# EAGLE design 12v-driver (EAGLE 9.4.2)
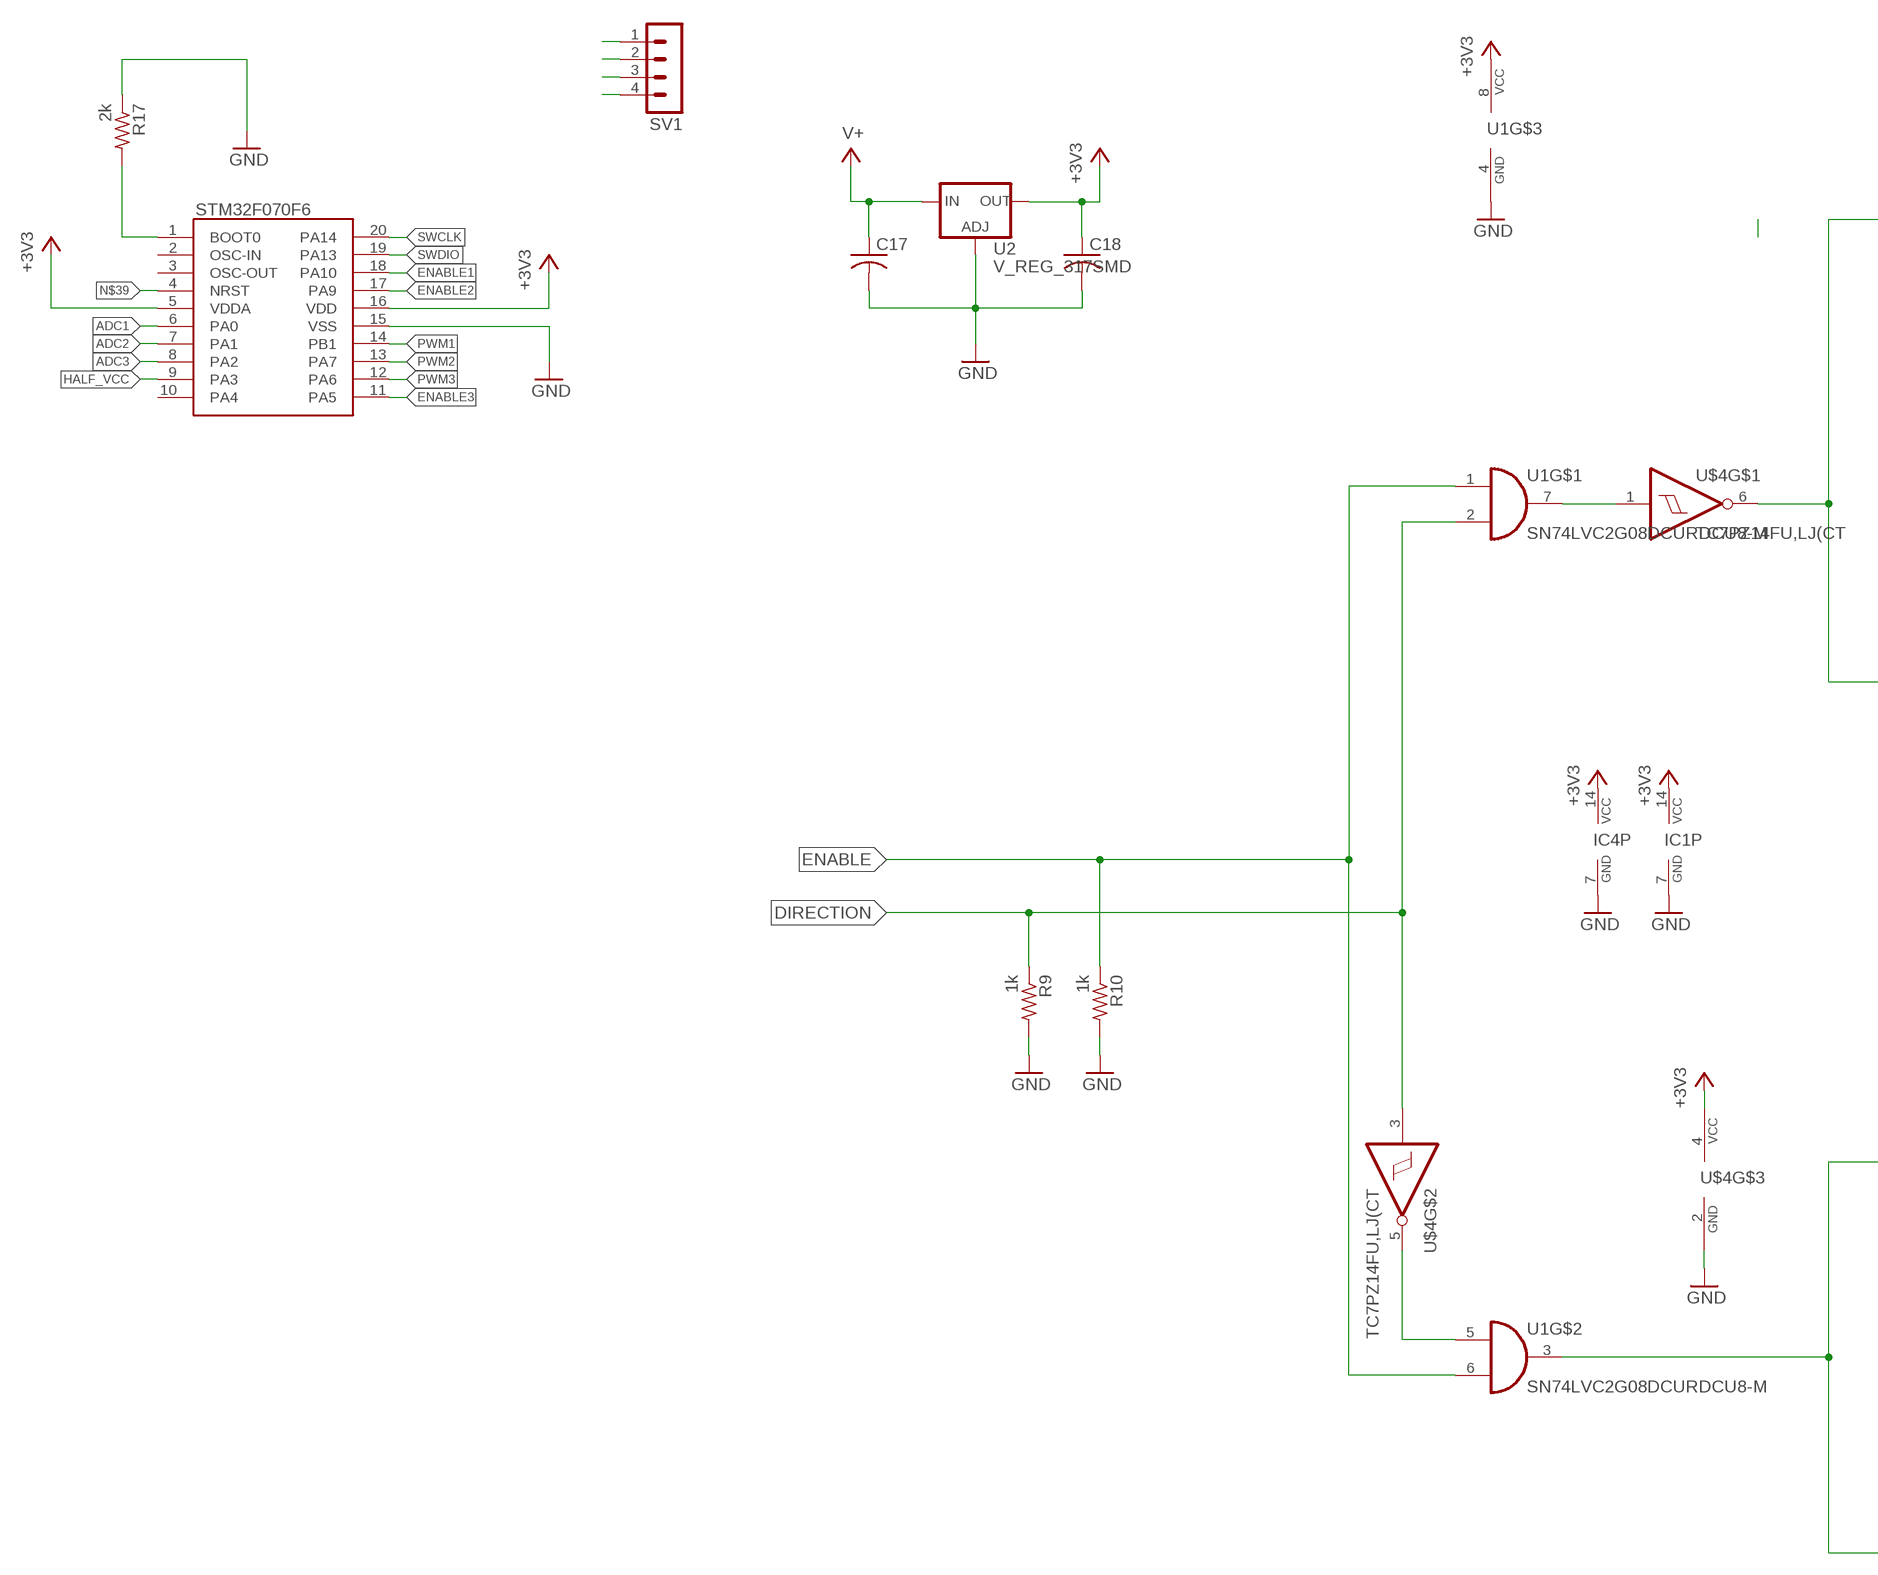
[diagram p0: schematic, sheet 1, part 1 of 2]
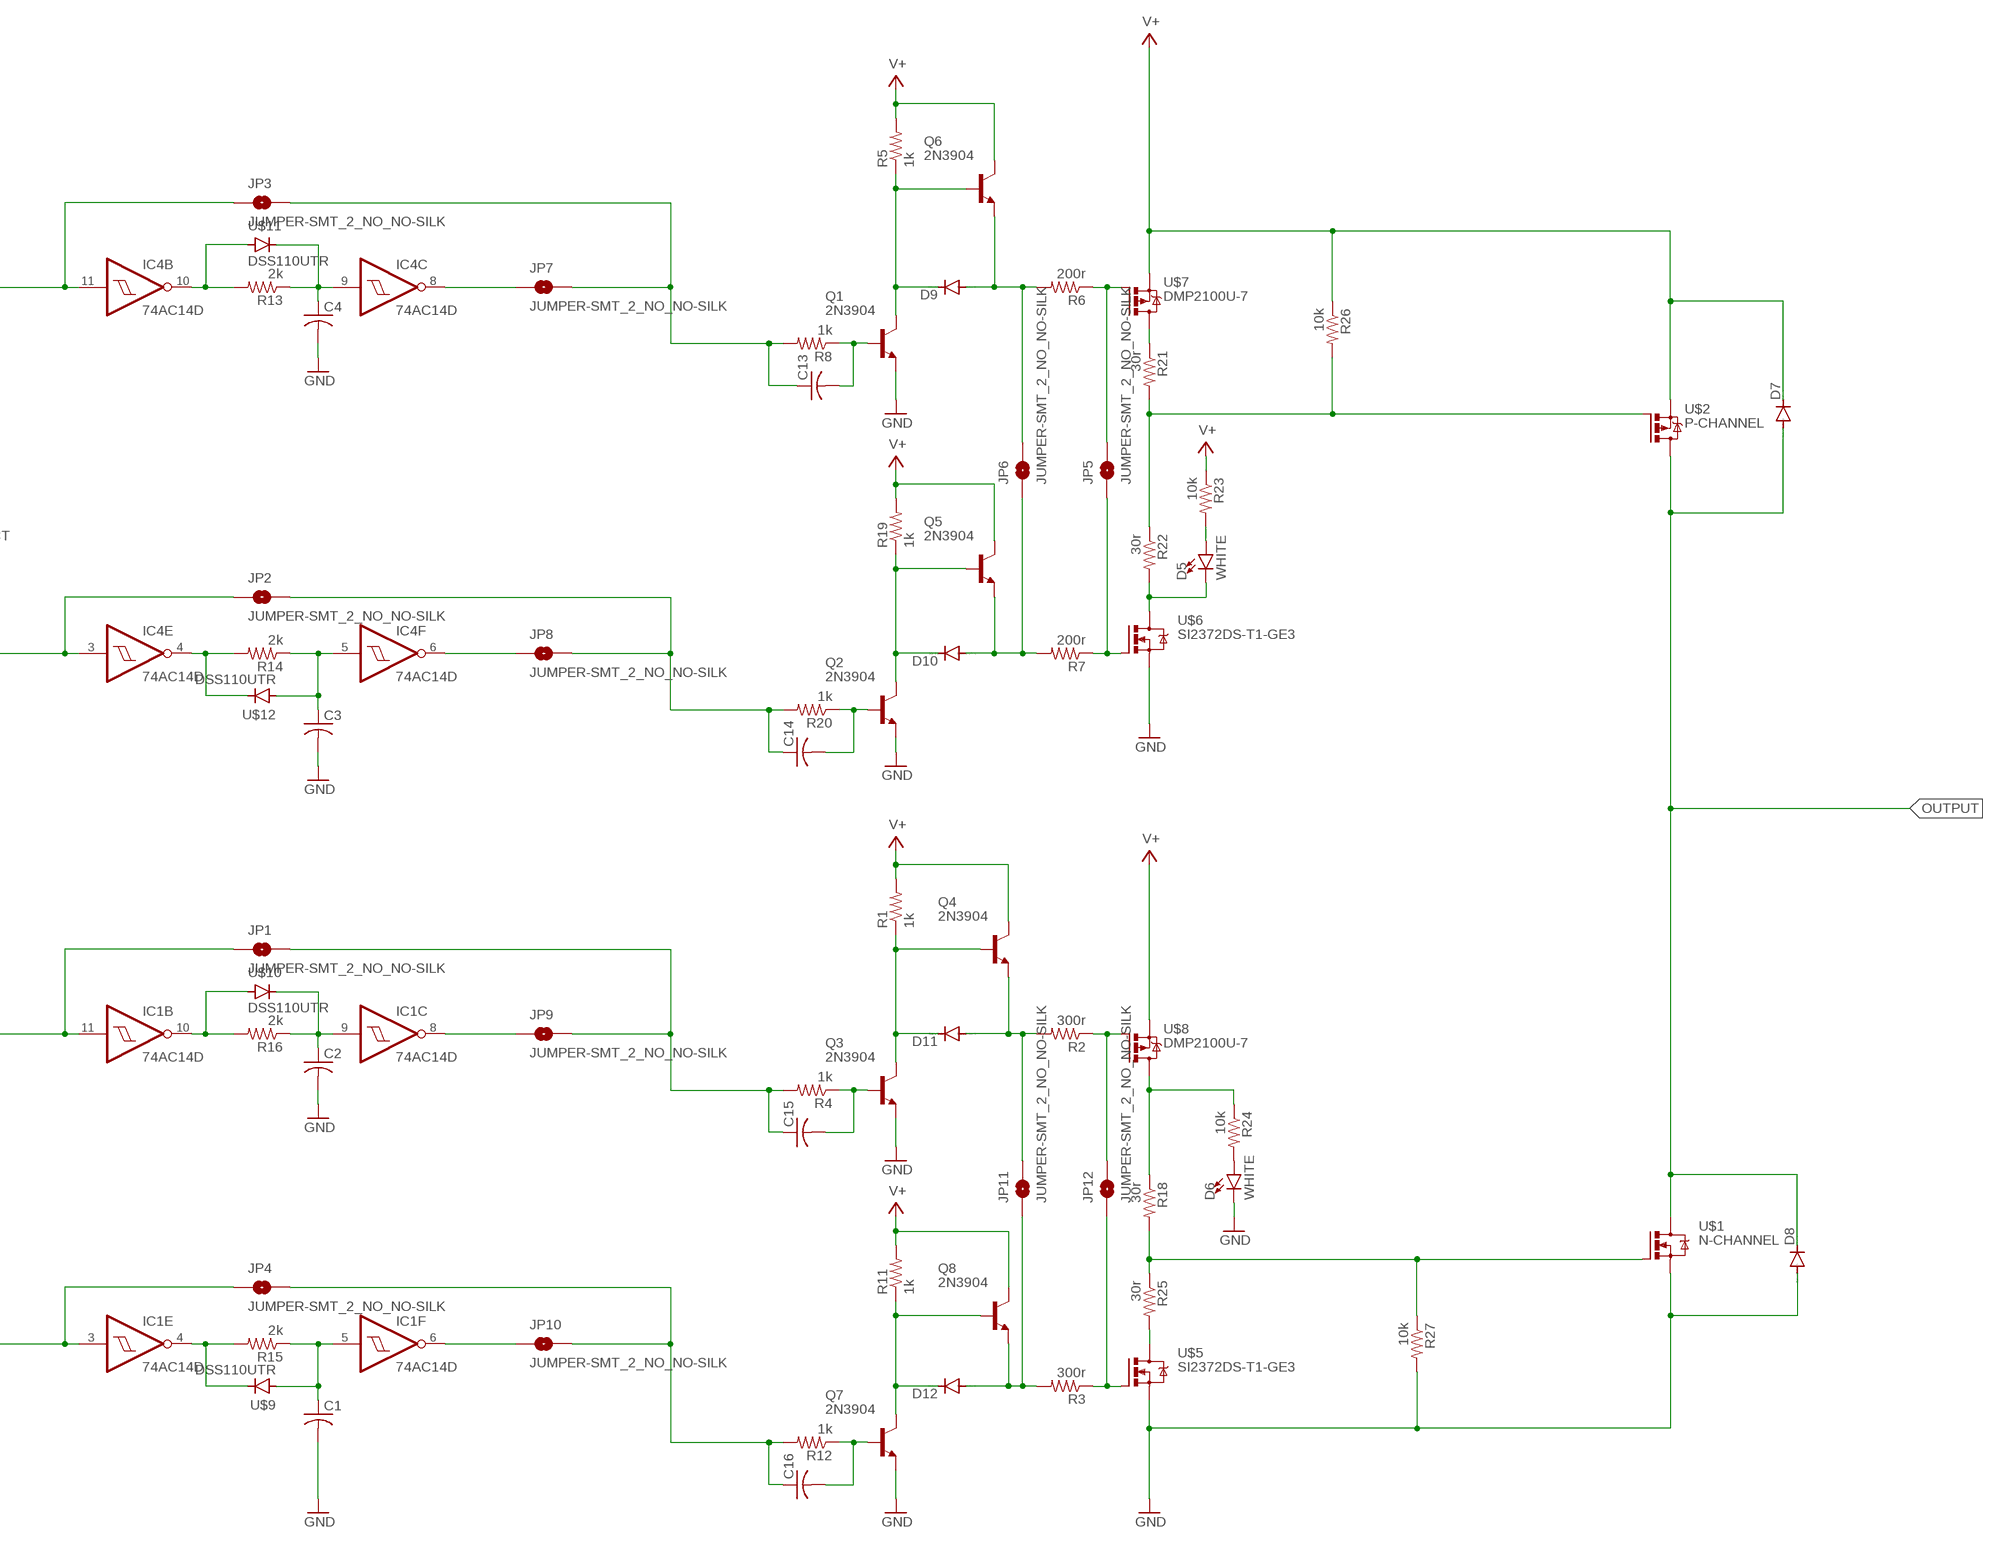
[diagram p1: schematic, sheet 1, part 2 of 2]

## Parts
C1  C-USC0603  [C0603]
C2  C-USC0603  [C0603]
C3  C-USC0603  [C0603]
C4  C-USC0603  [C0603]
C13  C-USC0603  [C0603]
C14  C-USC0603  [C0603]
C15  C-USC0603  [C0603]
C16  C-USC0603  [C0603]
C17  C-US075-032X103  [C075-032X103]
C18  C-US075-032X103  [C075-032X103]
D5  WHITE  LED-WHITE1206  [LED-1206]
D6  WHITE  LED-WHITE1206  [LED-1206]
D7  DIODE-DO-214AC  [DO-214AC]
D8  DIODE-DO-214AC  [DO-214AC]
D9  DIODE-DO-214AC  [DO-214AC]
D10  DIODE-DO-214AC  [DO-214AC]
D11  DIODE-DO-214AC  [DO-214AC]
D12  DIODE-DO-214AC  [DO-214AC]
IC1  74AC14D  [SO14]
IC4  74AC14D  [SO14]
JP1  JUMPER-SMT_2_NO_NO-SILK  [SMT-JUMPER_2_NO_NO-SILK]
JP2  JUMPER-SMT_2_NO_NO-SILK  [SMT-JUMPER_2_NO_NO-SILK]
JP3  JUMPER-SMT_2_NO_NO-SILK  [SMT-JUMPER_2_NO_NO-SILK]
JP4  JUMPER-SMT_2_NO_NO-SILK  [SMT-JUMPER_2_NO_NO-SILK]
JP5  JUMPER-SMT_2_NO_NO-SILK  [SMT-JUMPER_2_NO_NO-SILK]
JP6  JUMPER-SMT_2_NO_NO-SILK  [SMT-JUMPER_2_NO_NO-SILK]
JP7  JUMPER-SMT_2_NO_NO-SILK  [SMT-JUMPER_2_NO_NO-SILK]
JP8  JUMPER-SMT_2_NO_NO-SILK  [SMT-JUMPER_2_NO_NO-SILK]
JP9  JUMPER-SMT_2_NO_NO-SILK  [SMT-JUMPER_2_NO_NO-SILK]
JP10  JUMPER-SMT_2_NO_NO-SILK  [SMT-JUMPER_2_NO_NO-SILK]
JP11  JUMPER-SMT_2_NO_NO-SILK  [SMT-JUMPER_2_NO_NO-SILK]
JP12  JUMPER-SMT_2_NO_NO-SILK  [SMT-JUMPER_2_NO_NO-SILK]
Q1  2N3904  [TO-92]
Q2  2N3904  [TO-92]
Q3  2N3904  [TO-92]
Q4  2N3904  [TO-92]
Q5  2N3904  [TO-92]
Q6  2N3904  [TO-92]
Q7  2N3904  [TO-92]
Q8  2N3904  [TO-92]
R1  1k  R-US_R0603  [R0603]
R2  300r  R-US_R0603  [R0603]
R3  300r  R-US_R0603  [R0603]
R4  1k  R-US_R0603  [R0603]
R5  1k  R-US_R0603  [R0603]
R6  200r  R-US_R0603  [R0603]
R7  200r  R-US_R0603  [R0603]
R8  1k  R-US_R0603  [R0603]
R9  1k  R-US_R0603  [R0603]
R10  1k  R-US_R0603  [R0603]
R11  1k  R-US_R0603  [R0603]
R12  1k  R-US_R0603  [R0603]
R13  2k  R-US_R0603  [R0603]
R14  2k  R-US_R0603  [R0603]
R15  2k  R-US_R0603  [R0603]
R16  2k  R-US_R0603  [R0603]
R17  2k  R-US_R0603  [R0603]
R18  30r  R-US_R0603  [R0603]
R19  1k  R-US_R0603  [R0603]
R20  1k  R-US_R0603  [R0603]
R21  30r  R-US_R0603  [R0603]
R22  30r  R-US_R0603  [R0603]
R23  10k  R-US_R0603  [R0603]
R24  10k  R-US_R0603  [R0603]
R25  30r  R-US_R0603  [R0603]
R26  10k  R-US_R0603  [R0603]
R27  10k  R-US_R0603  [R0603]
SV1  MA04-1  [MA04-1]
U1  SN74LVC2G08DCURDCU8-M  [DCU8-M]
U2  V_REG_317SMD  [SOT223]
U$1  N-CHANNEL  [TO247BV]
U$2  P-CHANNEL  [TO247BV]
U$3  STM32F070F6P6TR  [TSSOP20]
U$4  TC7PZ14FU,LJ(CT  [SOT-363___(US6)]
U$5  SI2372DS-T1-GE3  [SOT-23]
U$6  SI2372DS-T1-GE3  [SOT-23]
U$7  DMP2100U-7  [SOT-23]
U$8  DMP2100U-7  [SOT-23]
U$9  DSS110UTR  [SOD123FL]
U$10  DSS110UTR  [SOD123FL]
U$11  DSS110UTR  [SOD123FL]
U$12  DSS110UTR  [SOD123FL]

## Nets
+3V3: C18.1 IC1.14(P:VCC) IC4.14(P:VCC) U1.8(VCC) U2.2(OUT) U$3.5(VDDA) U$3.16(VDD) U$4.4(VCC)
ADC1: U$3.6(PA0)
ADC2: U$3.7(PA1)
ADC3: U$3.8(PA2)
DIRECTION: R9.1 U1.2(I1) U$4.3(I)
ENABLE: R10.1 U1.1(I0) U1.6(I1)
ENABLE1: U$3.18(PA10)
ENABLE2: U$3.17(PA9)
ENABLE3: U$3.11(PA5)
GND: C1.2 C2.2 C3.2 C4.2 C17.2 C18.2 D6.C D8.A IC1.7(P:GND) IC4.7(P:GND) Q1.E Q2.E Q3.E Q7.E R9.2 R10.2 R17.1 R27.2 U1.4(GND) U2.1(ADJ) U$1.S U$3.15(VSS) U$4.2(GND) U$5.2(S) U$6.2(S)
HALF_VCC: U$3.9(PA3)
IN1: IC1.3(E:I) IC1.11(B:I) JP1.1 JP4.1 U1.3(O)
IN2: IC4.3(E:I) IC4.11(B:I) JP2.1 JP3.1 U$4.6(O)
N$1: R18.2 R25.1 R27.1 U$1.G
N$2: R17.2 U$3.1(BOOT0)
N$3: D11.C Q3.C Q4.B R1.1
N$4: JP12.2 R2.1 U$8.1(G)
N$5: JP12.1 R3.1 U$5.1(G)
N$6: C15.2 Q3.B R4.1
N$7: R21.2 R22.1 R26.2 U$2.G
N$8: R18.1 R24.1 U$8.3(D)
N$9: D9.C Q1.C Q6.B R5.1
N$10: JP5.2 R6.1 U$7.1(G)
N$11: JP5.1 R7.1 U$6.1(G)
N$12: C13.2 Q1.B R8.1
N$13: IC1.10(B:O) R16.2 U$10.A
N$14: IC4.8(C:O) JP7.1
N$15: U1.5(I0) U$4.5(O)
N$16: C2.1 IC1.9(C:I) R16.1 U$10.C
N$17: C15.1 JP1.2 JP9.2 R4.2
N$18: C3.1 IC4.5(F:I) R14.1 U$12.A
N$19: IC4.6(F:O) JP8.1
N$20: C4.1 IC4.9(C:I) R13.1 U$11.C
N$21: C13.1 JP3.2 JP7.2 R8.2
N$22: IC4.10(B:O) R13.2 U$11.A
N$23: IC4.4(E:O) R14.2 U$12.C
N$24: IC1.8(C:O) JP9.1
N$25: IC1.4(E:O) R15.2 U$9.C
N$26: C1.1 IC1.5(F:I) R15.1 U$9.A
N$27: IC1.6(F:O) JP10.1
N$28: C16.1 JP4.2 JP10.2 R12.2
N$29: D5.A R23.2
N$30: D6.A R24.2
N$31: C16.2 Q7.B R12.1
N$32: D12.C Q7.C Q8.B R11.1
N$33: C14.2 Q2.B R20.1
N$34: C14.1 JP2.2 JP8.2 R20.2
N$35: D10.C Q2.C Q5.B R19.1
N$36: SV1.1
N$37: SV1.2
N$38: U1.7(O) U$4.1(I)
N$39: U$3.4(NRST)
N$40: R21.1 U$7.3(D)
N$41: D5.C R22.2 U$6.3(D)
N$42: R25.2 U$5.3(D)
N$43: D9.A JP6.2 Q6.E R6.2
N$44: D10.A JP6.1 Q5.E R7.2
N$46: SV1.3
N$47: D11.A JP11.2 Q4.E R2.2
N$48: D12.A JP11.1 Q8.E R3.2
N$49: SV1.4
OUTPUT: D7.A D8.C U$1.D U$2.D
PWM1: U$3.14(PB1)
PWM2: U$3.13(PA7)
PWM3: U$3.12(PA6)
SWCLK: U$3.20(PA14)
SWDIO: U$3.19(PA13)
V+: C17.1 D7.C Q4.C Q5.C Q6.C Q8.C R1.2 R5.2 R11.2 R19.2 R23.1 R26.1 U2.3(IN) U$2.S U$7.2(S) U$8.2(S)
Unconnected: IC1.1(D:I) IC1.2(D:O) IC1.12(A:O) IC1.13(A:I) IC4.1(D:I) IC4.2(D:O) IC4.12(A:O) IC4.13(A:I) U$3.2(OSC-IN) U$3.3(OSC-OUT) U$3.10(PA4)

## Library data of the parts
C1-C4 C13-C18 = rcl:C-US: CAPACITOR, American symbol; SPICEPREFIX: C
D5 D6 = SparkFun-LED:LED-WHITE: White SMD LED Used in manufacturing several products at SparkFun. Packages: 0603 - Bright White SMD 0603 package[Product Link] <http://www.kingbrightusa.com/product.asp?catalog_name=LED&product_id=APT1608QWF/D> 1206 - Bright White SMD1206 package [Product Link] <http://www.kingbrightusa.com/product.asp?catalog_name=LED&product_id=APT3216QWF/D> 3014 - Super Bright SMD 3014 package [Datasheet] <http://www.lumileds.com/uploads/459/DS208-pdf> SparkFun Products: Blackberry Trackballer Breakout <https://www.sparkfun.com/products/13169> Digital SandBox <https://www.sparkfun.com/products/12651>; PROD_ID: DIO-09955
D7-D12 = diode:DIODE-: DIODE
IC1 IC4 = 74xx-eu:74*14: Hex schmitt trigger INVERTER
JP1-JP12 = SparkFun-Jumpers:JUMPER-SMT_2_NO: Normally open jumper This jumper has two pads in close proximity to each other. Apply solder to close the connection. Round pads are easier to solder for beginners, but are a lot larger. SparkFun Product that uses the round pads: SparkFun EL Sequencer <https://www.sparkfun.com/products/12781>
Q1-Q8 = BLDC:2N3904
R1-R27 = rcl:R-US_: RESISTOR, American symbol; SPICEPREFIX: R
SV1 = con-lstb:MA04-1: PIN HEADER; OC_FARNELL: unknown; OC_NEWARK: unknown
U1 = BLDC:SN74LVC2G08DCUR; DATASHEET_URL: http://www.ti.com/lit/gpn/SN74LVC2G08; DESCRIPTION: Dual 2-Input Positive-AND Gate; FAMILY_NAME: LL AND GATE; GENERIC_PART_NUMBER: SN74LVC2G08; INDUSTRY_STD_PKG_TYPE: US8; MANUFACTURER: Texas Instruments; MANUFACTURER_PART_NUMBER: SN74LVC2G08DCUR; PACKAGE_DESIGNATOR: DCU; PIN_COUNT: 8; VENDOR: Texas Instruments
U2 = SparkFun-IC-Power:V_REG_317: Voltage Regulator Standard LM317 adjustable voltage regulator. AOI (Adjust Output Input). Google 'LM317 Calculator' for easy to use app to get the two resistor values needed. 240/720 for 5V output. 240/390 for 3.3V output. Spark Fun Electronics SKU : COM-00527
U$1 = transistors:N-CHANNEL
U$2 = transistors:P-CHANNEL
U$3 = Capstone:STM32F070F6P6TR
U$4 = BLDC:TC7PZ14FU,LJ(CT
U$5 U$6 = BLDC:SI2372DS-T1-GE3
U$7 U$8 = BLDC:DMP2100U-7
U$9-U$12 = BLDC:DSS110UTR

## Board
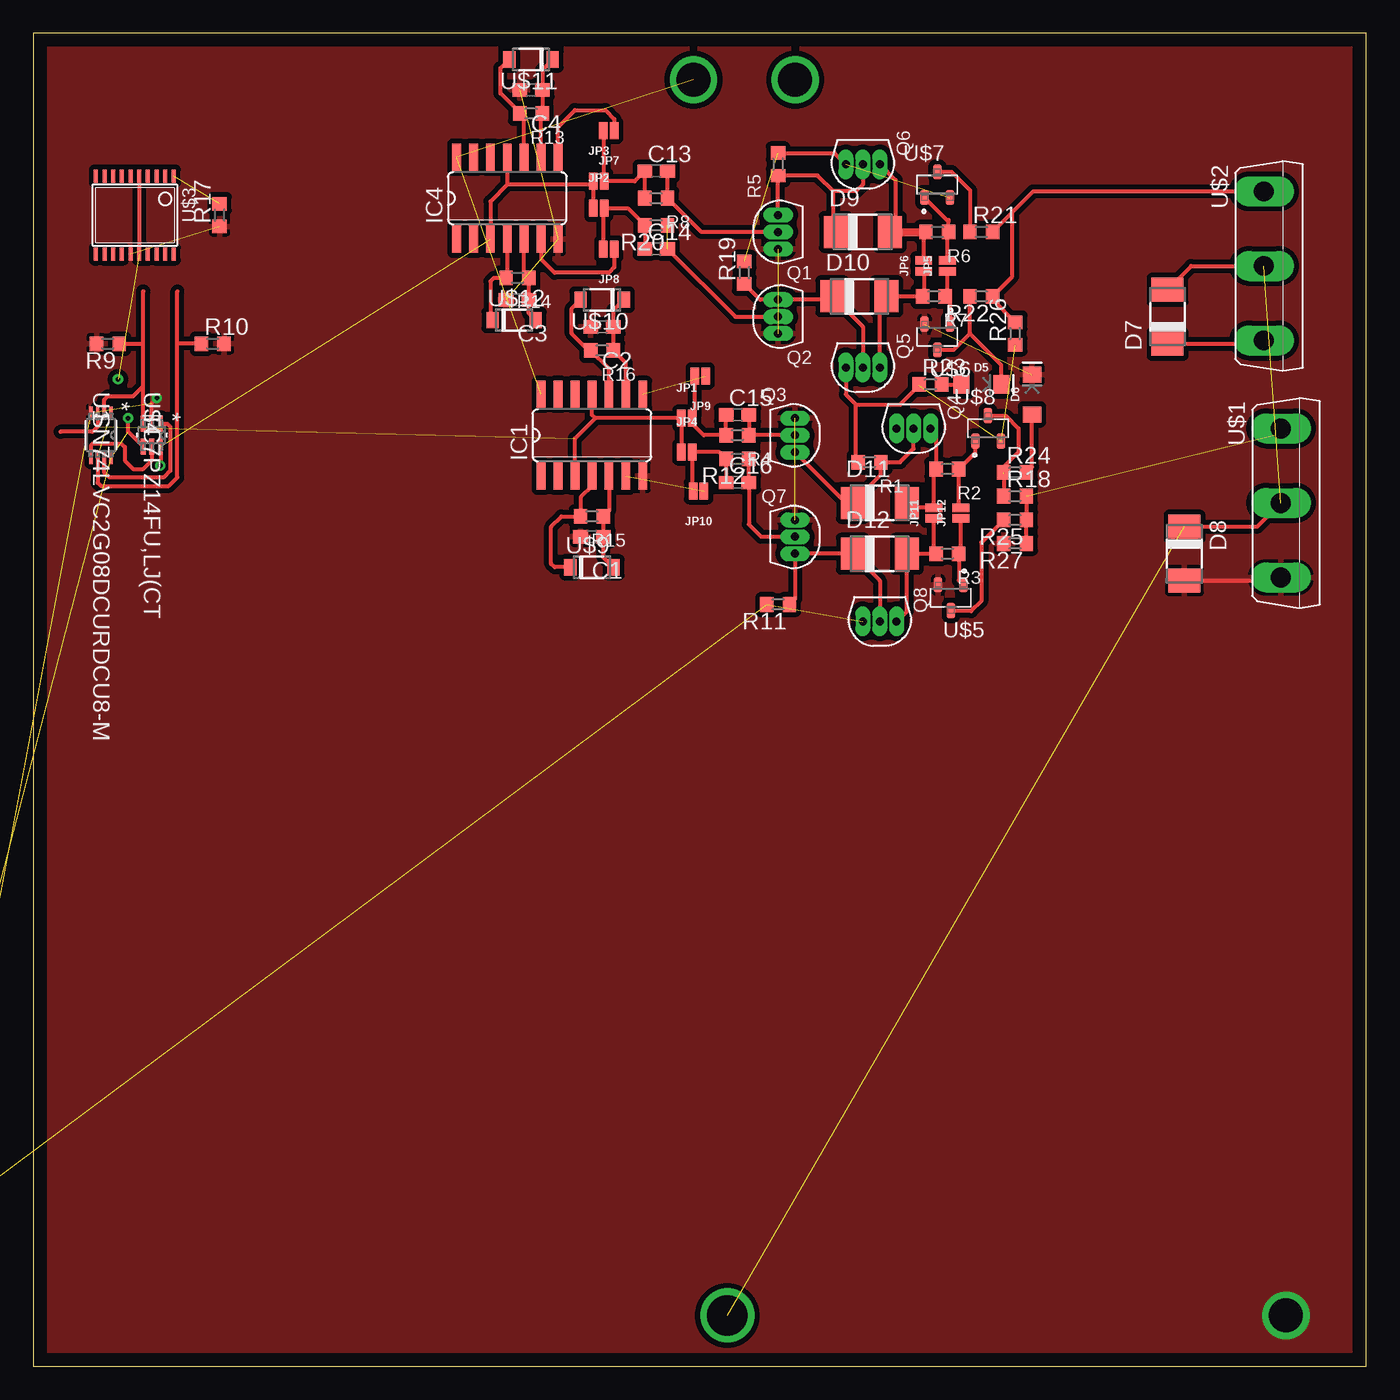
[diagram p2: board, top side]
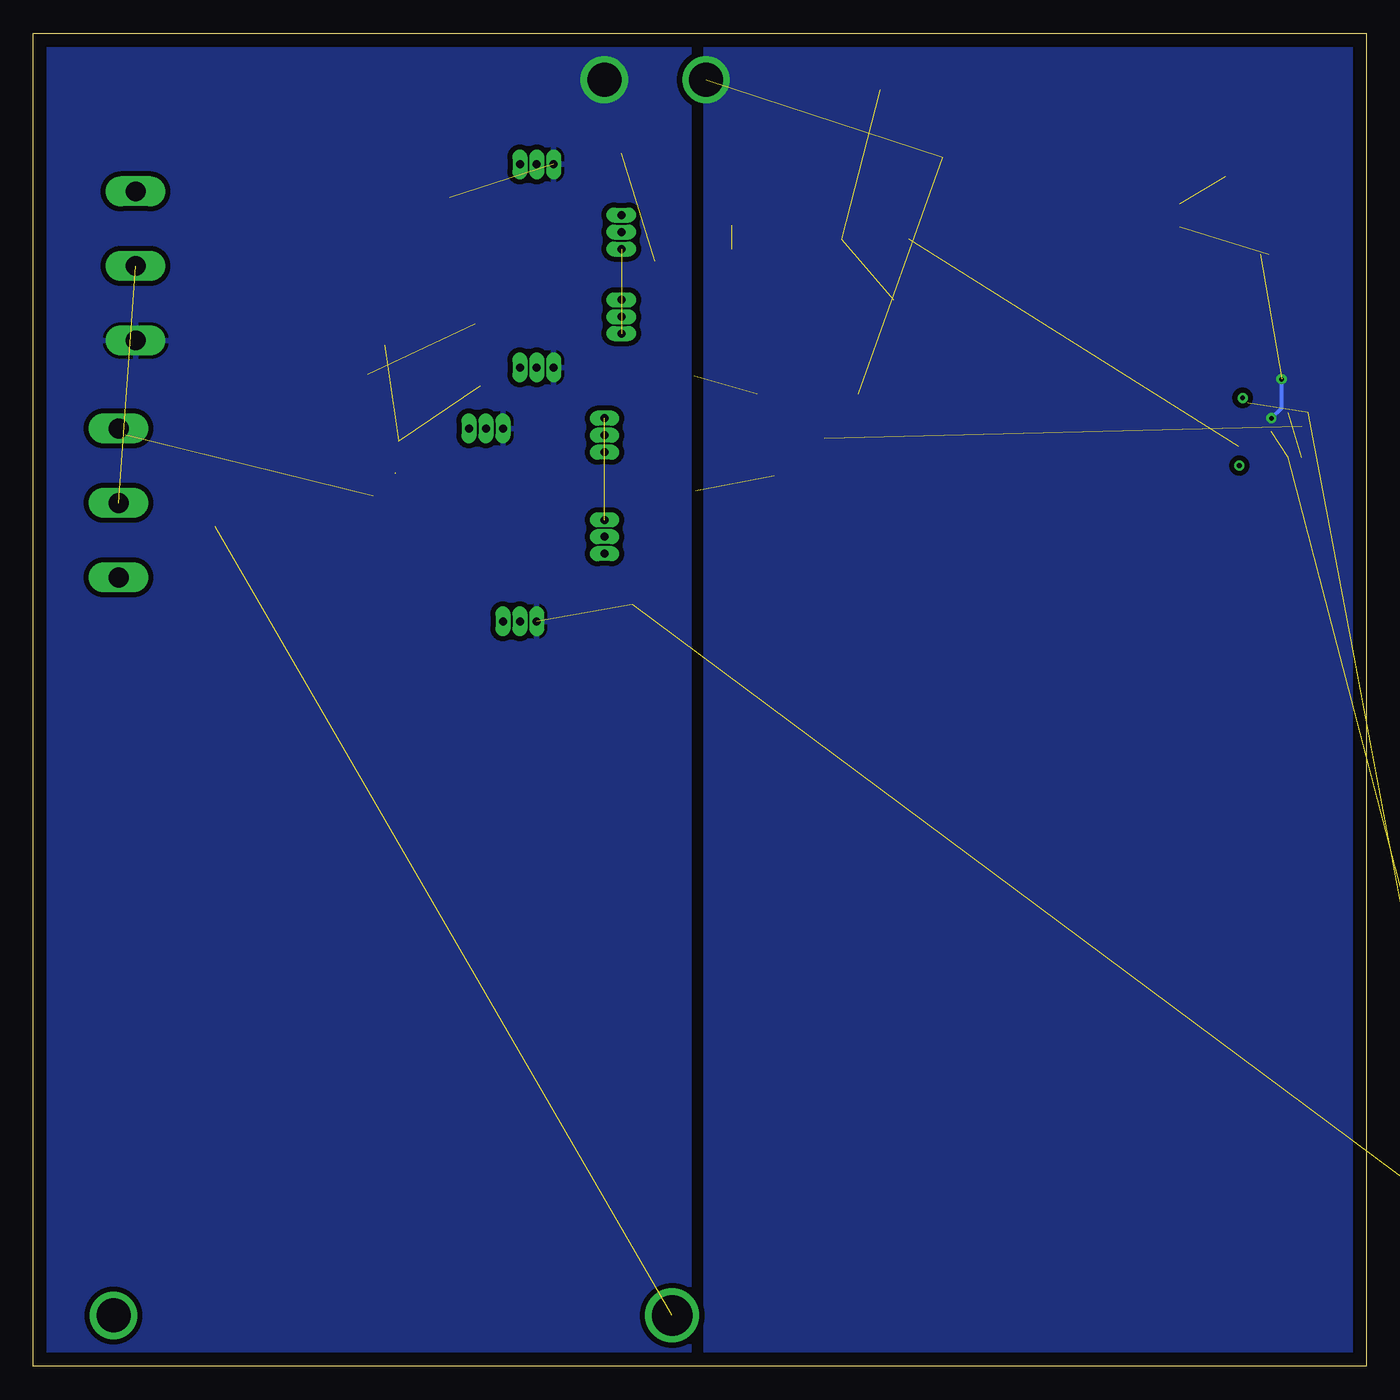
[diagram p3: board, bottom side, seen from below]

Size 100 x 100 mm. Coordinates in mm from the lower left corner, seen from the top.
Outline: 0,0 100,0 100,100 0,100 0,0
Copper layers (1*16): Top 0.035mm / dielectric 1.5mm / Bottom 0.035mm
Design rules "default": minimum track width 6mil, minimum drill 0.35mm, track to track 6mil, track to pad 6mil, pad to pad 6mil, via to via 6mil, smd to smd 6mil, copper to edge 40mil, drill to drill 6mil, minimum pad ring 10mil, minimum via ring 8mil, stop-mask expansion 4mil, vias tented up to drill 0mil, thermal gap 10mil

### Footprints (pad centres in the part's own frame; a part is rotated, then mirrored left to right if it is on the bottom)
C0603 = smd 1.1 x 1: 1 -0.85,0; 2 0.85,0
C075-032X103 = drill 0.914 octagon: 1 -3.81,0; 2 3.81,0
LED-1206 = smd 1.2 x 1.4: A -1.5,0; C 1.5,0
DO-214AC = smd 1.8 x 2.4: A 2.025,0; C -2.025,0
SO14 = smd 0.66 x 2.032: 1 -3.81,-3.073; 2 -2.54,-3.073; 3 -1.27,-3.073; 4 0,-3.073; 5 1.27,-3.073; 6 2.54,-3.073; 7 3.81,-3.073; 8 3.81,3.073; 9 2.54,3.073; 10 1.27,3.073; 11 0,3.073; 12 -1.27,3.073; 13 -2.54,3.073; 14 -3.81,3.073
SMT-JUMPER_2_NO_NO-SILK = smd 0.635 x 1.27: 1 -0.406,0; 2 0.406,0
TO-92 = drill 0.6 pad 0.762 long: B 0,0; C 0,-1.27; E 0,1.27
R0603 = smd 1 x 1.1: 1 -0.85,0; 2 0.85,0
MA04-1 = drill 1.016 long: 1 -3.81,0; 2 -1.27,0; 3 1.27,0; 4 3.81,0
DCU8-M = smd 0.965 x 0.254: 1 -1.676,0.75; 2 -1.676,0.25; 3 -1.676,-0.25; 4 -1.676,-0.75; 5 1.676,-0.75; 6 1.676,-0.25; 7 1.676,0.25; 8 1.676,0.75
SOT223 = smd 1.219 x 2.235: 1 -2.311,-3.099; 2 0,-3.099; 3 2.311,-3.099 | smd 3.6 x 2.2: 4 0,3.099
TO247BV = drill 1.499 long: D 0,-2.921; G -5.588,-2.921; S 5.588,-2.921
TSSOP20 = smd 0.305 x 0.991: 1 -2.925,-2.918; 2 -2.275,-2.918; 3 -1.625,-2.918; 4 -0.975,-2.918; 5 -0.325,-2.918; 6 0.325,-2.918; 7 0.975,-2.918; 8 1.625,-2.918; 9 2.275,-2.918; 10 2.925,-2.918; 11 2.925,2.918; 12 2.275,2.918; 13 1.625,2.918; 14 0.975,2.918; 15 0.325,2.918; 16 -0.325,2.918; 17 -0.975,2.918; 18 -1.625,2.918; 19 -2.275,2.918; 20 -2.925,2.918
SOT-363___(US6) = smd 1.194 x 0.356: 1 -0.864,0.65; 2 -0.864,0; 3 -0.864,-0.65; 4 0.864,-0.65; 5 0.864,0; 6 0.864,0.65
SOT-23 = smd 0.62 x 1.13: 1 -0.95,-0.96; 2 0.95,-0.96; 3 0,0.96
SOD123FL = smd 0.91 x 1.22: A 1.625,0; C -1.625,0

### Placement (x,y rotation side)
C1  41.91,62.23 180 top
C2  42.67,77.98 180 top
C3  36.32,80.01 180 top
C4  37.34,95.76 180 top
C13  46.74,89.66 0 top
C14  46.74,83.82 0 top
C15  52.83,71.37 0 top
C16  52.83,66.29 0 top
C17  -7.62,-6.35 0 top  (outside the outline)
C18  -7.62,-12.7 0 top  (outside the outline)
D5  71.12,73.66 0 top
D6  74.93,72.9 90 top
D7  85.09,78.74 90 top
D8  86.36,60.96 270 top
D9  62.23,85.09 0 top
D10  61.98,80.26 0 top
D11  63.5,64.77 0 top
D12  63.5,60.96 0 top
IC1  41.91,69.85 0 top
IC4  35.56,87.63 0 top
JP1  49.02,71.12 0 top
JP2  42.42,86.87 0 top
JP3  42.42,88.9 0 top
JP4  49.02,68.58 0 top
JP5  68.58,82.55 90 top
JP6  66.8,82.55 90 top
JP7  43.18,92.71 180 top
JP8  43.18,83.82 180 top
JP9  50.04,74.3 180 top
JP10  49.91,65.66 180 top
JP11  67.56,64.01 90 top
JP12  69.6,64.01 90 top
Q1  55.88,85.09 180 top
Q2  55.88,78.74 180 top
Q3  57.15,69.85 0 top
Q4  66.04,70.36 270 top
Q5  62.23,74.93 270 top
Q6  62.23,90.17 270 top
Q7  57.15,62.23 0 top
Q8  63.5,55.88 270 top
R1  62.74,67.82 180 top
R2  68.58,67.31 180 top
R3  68.58,60.96 180 top
R4  52.83,69.85 180 top
R5  55.88,90.17 90 top
R6  67.82,85.09 180 top
R7  67.56,80.26 180 top
R8  46.74,87.63 180 top
R9  5.59,76.71 180 top
R10  13.46,76.71 0 top
R11  55.88,57.15 180 top
R12  52.83,68.07 180 top
R13  37.34,93.98 180 top
R14  36.32,81.66 180 top
R15  41.91,63.75 180 top
R16  42.67,76.2 180 top
R17  13.97,86.36 90 top
R18  73.66,65.28 0 top
R19  53.34,82.04 90 top
R20  46.74,85.6 180 top
R21  71.12,85.09 0 top
R22  71.12,80.26 180 top
R23  67.31,73.66 0 top
R24  73.66,67.06 0 top
R25  73.66,63.5 180 top
R26  73.66,77.47 90 top
R27  73.66,61.72 180 top
SV1  -6.35,-17.78 0 top  (outside the outline)
U1  5.08,69.85 270 top
U2  -10.16,3.81 180 top  (outside the outline)
U$1  96.52,64.77 270 top
U$2  95.25,82.55 270 top
U$3  7.62,86.36 180 top
U$4  8.89,69.85 270 top
U$5  68.83,57.66 180 top
U$6  67.82,77.22 180 top
U$7  67.82,88.65 0 top
U$8  71.63,70.36 0 top
U$9  41.91,59.94 0 top
U$10  42.67,80.01 180 top
U$11  37.34,98.04 180 top
U$12  36.07,78.49 0 top

### Tracks (layer width: path | path; a pad name or v marks a point on that pad's centre or on a via)
+3V3  (via drill 0.35, 2.54)  (6 unrouted)
  Top 0.152: 7.95,83.82 U$3.16
  Top 0.305: U$3.5 7.95,83.82 | U$4.4 7.11,70.11 v7.11,71.12
  Bottom 0.305: v7.11,71.12 6.35,71.88 v6.35,74.04
  other vias: 49.53,96.52
  pour Bottom (isolate 0.381): -6.35,105.41 49.53,105.41 49.53,-1.27 -6.35,-1.27
DIRECTION
  Top 0.305: U$4.3 8.24,73.52 | 8.24,73.52 8.24,76.71 | 8.24,76.71 8.24,80.63 8.26,80.64 | U1.2 5.33,72.51 5.59,72.77 7.49,72.77 8.24,73.52 | R9.1 8.24,76.71
ENABLE  (1 unrouted)
  Top 0.305: U1.6 4.83,66.29 5.08,66.04 10.16,66.04 10.79,66.67 10.79,76.71 | 10.79,76.71 10.79,80.64 | R10.1 10.79,76.71
GND  (via drill 0.35, 2.54)  (10 unrouted)
  Top 0.305: U$4.2 8.89,72.26 v9.27,72.64 | D8.A 93.35,58.94 U$1.S
  other vias: 93.98,3.81
  pour Top (isolate 0.381): -5.08,106.68 100.33,106.68 100.33,0 -5.08,0
IN1  (1 unrouted)
  Top 0.305: U1.3 4.83,70.49 4.45,70.1 2.03,70.1 | 42.16,71.12 41.91,71.37 IC1.11 | 42.16,71.12 JP1.1 JP4.1 | IC1.3 40.64,69.6 42.16,71.12
IN2  (via drill 0.35)  (1 unrouted)
  Top 0.305: U$4.6 9.54,67.58 v9.53,67.56 | IC4.11 35.56,88.65 | IC4.3 34.29,87.38 35.56,88.65 | JP2.1 JP3.1 41.76,88.65 35.56,88.65
N$1  (1 unrouted)
  Top 0.305: R18.2 R25.1 R27.1
  Top 1.219: 93.09,69.85 U$1.G
N$2  (1 unrouted)
N$3
  Top 0.305: Q3.C 60.96,64.77 D11.C 63.59,66.88 R1.1 65.02,67.82 66.04,68.83 Q4.B
N$4
  Top 0.305: JP12.2 69.43,64.58 R2.1 70.68,68.56 U$8.1
N$5
  Top 0.305: JP12.1 69.6,61.13 R3.1 69.43,58.97 U$5.1
N$6
  Top 0.305: Q3.B R4.1 C15.2
N$7
  Top 0.305: R21.2 73.45,86.57 | 73.45,86.57 75.02,88.14 U$2.G | R22.1 72.05,80.35 | 72.05,80.35 73.45,81.74 73.45,86.57 | R26.2 72.05,79.93 72.05,80.35
  Top 1.219: 91.82,87.63 U$2.G
N$8  (1 unrouted)
  Top 0.305: U$8.3 72.95,71.32 73.91,70.36 73.91,68.58 72.81,67.48 R24.1 | 72.81,66.97 R18.1
N$9
  Top 0.305: Q1.C R5.1 58.84,89.32 60.02,88.14 | Q6.B 62.23,88.65 61.72,88.14 60.02,88.14 | D9.C 60.02,85.27 60.02,88.14
N$10
  Top 0.305: R6.1 68.67,86.02 | R6.1 68.67,85.89 U$7.1 | JP5.2 68.58,85 R6.1
N$11
  Top 0.305: U$6.1 68.77,79.91 R7.1 68.58,80.43 JP5.1
N$12
  Top 0.305: Q1.B 50.13,85.09 R8.1 C13.2
N$13
  Top 0.305: U$10.A 40.39,79.35 40.39,77.47 41.66,76.2 R16.2 43.18,74.84 IC1.10
N$14
  Top 0.305: IC4.8 39.37,92.96 40.64,94.23 42.93,94.23 43.59,93.57 JP7.1
N$15
  Top 0.305: U1.5 4.33,69.1 4.45,69.22 6.6,69.22 6.86,68.96 6.86,67.94 7.49,67.31 8.26,67.31 8.89,67.94 U$4.5
N$16
  Top 0.305: IC1.9 44.45,75.27 R16.1 C2.1 43.52,79.23 U$10.C
N$17
  Top 0.305: JP9.2 49.63,71.32 JP1.2 49.43,70.71 50.29,69.85 R4.2 C15.1 51.73,71.12
N$18
  Top 0.305: IC4.5 36.83,82 R14.1 C3.1 37.17,79.01 U$12.A
N$19
  Top 0.305: IC4.6 38.1,83.06 39.12,82.04 43.18,82.04 43.59,82.45 JP8.1
N$20
  Top 0.305: U$11.C 38.19,97.27 C4.1 R13.1 38.1,93.89 IC4.9
N$21
  Top 0.305: JP7.2 42.82,92.66 JP3.2 45.12,88.9 C13.1 R8.2
N$22
  Top 0.305: IC4.10 36.83,93.64 R13.2 36.49,94.07 35.05,95.5 35.05,97.38 U$11.A
N$23
  Top 0.305: U$12.C 34.29,78.64 34.29,81.39 34.56,81.66 R14.2 35.56,81.66 IC4.4
N$24  (1 unrouted)
N$25
  Top 0.305: IC1.4 41.91,66.04 41.06,65.19 R15.2 39.62,63.75 38.86,62.99 38.86,60.2 39.12,59.94 U$9.C
N$26
  Top 0.305: IC1.5 43.18,64.17 R15.1 C1.1 42.76,60.72 U$9.A
N$27  (1 unrouted)
N$28
  Top 0.305: JP10.2 49.43,65.73 JP4.2 51.47,68.58 R12.2 C16.1
N$29
  Top 0.305: R23.2 D5.A
N$30
  Top 0.305: R24.2 74.93,67.48 D6.A
N$31
  Top 0.305: R12.1 C16.2 53.68,63.16 54.61,62.23 Q7.B
N$32
  Top 0.305: Q8.B 63.5,58.94 D12.C Q7.C 57.15,57.57 R11.1
N$33  (1 unrouted)
  Top 0.305: C14.2 52.67,78.74 Q2.B
N$34
  Top 0.305: JP8.2 42.77,86.82 JP2.2 44.62,86.87 R20.2 C14.1
N$35
  Top 0.305: R19.1 54.52,80.01 Q2.C 59.7,80.01 D10.C 62.23,77.98 Q5.B
N$38
  Top 0.305: U$4.1 10.06,70.71 10.29,70.48 10.29,67.18 9.78,66.67 5.71,66.67 5.33,67.06 U1.7
N$40
  Top 0.305: U$7.3 68.89,89.61 70.27,88.23 R21.1
N$41
  Top 0.305: 70.27,77.47 R22.2 | U$6.3 69.06,76.26 70.27,77.47 | D5.C 72.62,75.12 70.27,77.47
N$42
  Top 0.305: R25.2 71.12,61.81 71.12,57.4 70.36,56.64 68.89,56.64 U$5.3
N$43
  Top 0.305: D9.A 64.25,85.14 64.5,85.17 64.73,85.47 64.69,85.85 64.69,88.98 Q6.E | JP6.2 66.8,84.92 R6.2
  Top 0.61: D9.A R6.2
N$44
  Top 0.305: JP6.1 66.8,80.35 R7.2 64.77,80.26 D10.A 63.75,80.26 63.5,80.01 Q5.E
N$47
  Top 0.305: D11.A 65.88,64.41 JP11.2 67.56,67.14 R2.2 67.73,69.94 Q4.E
N$48
  Top 0.305: JP11.1 67.56,61.13 R3.2 D12.A 65.53,56.63 Q8.E
OUTPUT  (via drill 3.05)  (2 unrouted)
  Top 0.305: D7.A 86.88,82.55 U$2.D | D8.C 91.81,62.98 U$1.D
  other vias: 52.07,3.81
V+  (via drill 2.54)  (7 unrouted)
  Top 0.305: R5.2 60.11,91.02 Q6.C | Q5.C 60.96,72.9 61.72,72.14 | 61.72,72.14 65.02,72.14 66.46,73.57 R23.1 | R1.2 61.72,67.98 61.72,72.14 | D7.C 92.08,76.72 U$2.S
  other vias: 57.15,96.52
  pour Bottom (isolate 0.381): 50.8,104.14 100.33,104.14 100.33,0 50.8,0